# Altium schematic sheet powerSupply.SchDoc: DE:TMP:11:UC:EXPANDIDO
size 233 x 233 mm; Date: 21-07-2022; SheetNumber: 1; SheetTotal: 1; WebFGR: www.abebashop.com; VersionFGR: 20220721; PageSetup: Record=PageOptions|CenterHorizontal=True|CenterVertical=True|PrintScale=0.94|XCorrection=1.00|YCorrection=1.00|PrintKind=0|BorderSize=5000000|LeftOffset=0|BottomOffset=0|Orientation=2|PaperLength=1000|PaperWidth=1000|Scale=100|PaperSource=7|PrintQuality=-4|MediaType=1|DitherType=10|PaperKind=Letter|PrintScaleMode=1
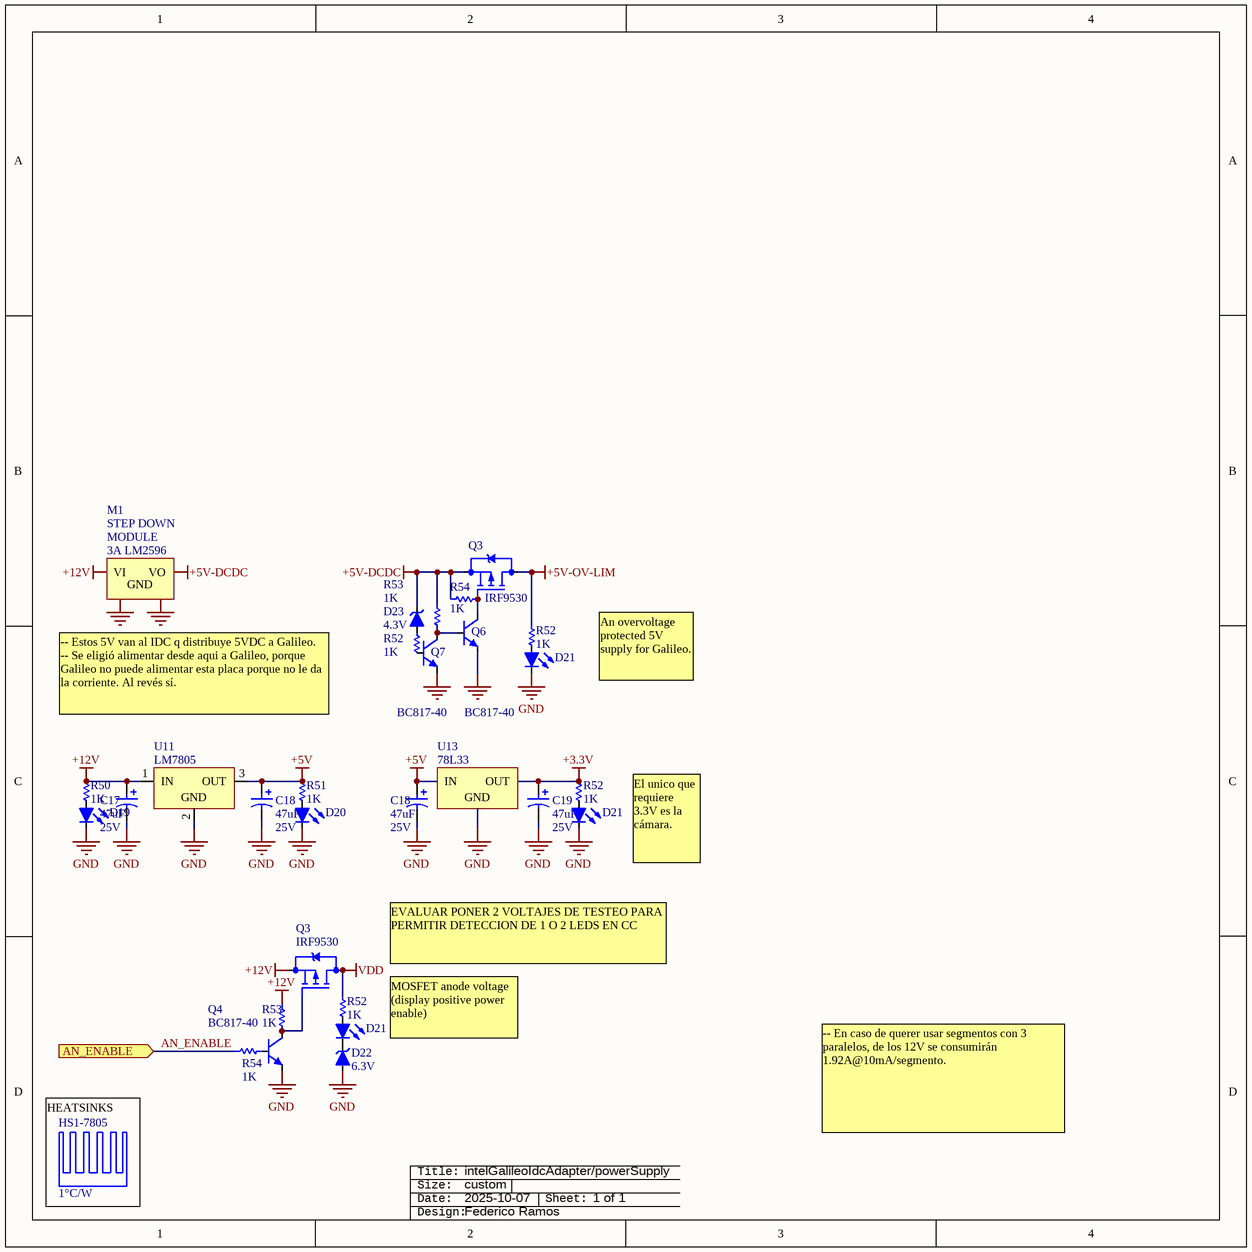
[diagram p0: powerSupply.SchDoc]

## Parts
(Parts that share a designator on the sheet are numbered #1, #2 ... from top to bottom, then left to right.)
C17  value 47uF  Voltaje: 25V  [C_EL_6-3X11]  (hidden comment: Cap Pol)
C18#1  value 47uF  Voltaje: 25V  [C_EL_6-3X11]  (hidden comment: Cap Pol)
C18#2  value 47uF  Voltaje: 25V  [C_EL_6-3X11]  (hidden comment: Cap Pol)
C19  value 47uF  Voltaje: 25V  [C_EL_6-3X11]  (hidden comment: Cap Pol)
D19  Led 5mm Rojo Difuso  [LED5mm ROJO]  (value not drawn)
D20  Led 5mm Rojo Difuso  [LED5mm ROJO]  (value not drawn)
D21#1  Led 5mm Rojo Difuso  [LED5mm ROJO]  (value not drawn)
D21#2  Led 5mm Rojo Difuso  [LED5mm ROJO]  (value not drawn)
D21#3  Led 5mm Rojo Difuso  [LED5mm ROJO]  (value not drawn)
D22  VOLTAJE: 6.3V  [D_SOD27]  (hidden comment: Zener)
D23  VOLTAJE: 4.3V  [D_SOD27]  (hidden comment: Zener)
HS1-7805  Thermal Resistance: 1°C/W  [HeatSink06]  (hidden comment: HEAT SINK)
M1  MODULE STEP DOWN 3A LM2596  [LM2596 MODULE]  (value not drawn)
Q3#1  IRF9530  [TO220]
Q3#2  IRF9530  [TO220]
Q4  BC817-40  [SOT23]
Q6  BC817-40  [SOT23]
Q7  BC817-40  [SOT23]
R50  value 1K  [R1206]  (hidden comment: Res)
R51  value 1K  [R1206]  (hidden comment: Res)
R52#1  value 1K  [R1206]  (hidden comment: Res)
R52#2  value 1K  [R1206]  (hidden comment: Res)
R52#3  value 1K  [R1206]  (hidden comment: Res)
R52#4  value 1K  [R1206]  (hidden comment: Res)
R53#1  value 1K  [R1206]  (hidden comment: Res)
R53#2  Resistencia: 1K  [R1206]  (hidden comment: Resistencia 1206; 1Kohm)
R54#1  Resistencia: 1K  [R1206]  (hidden comment: Resistencia 1206; 1Kohm)
R54#2  Resistencia: 1K  [res300th]  (hidden comment: Resistencia 1206; 1Kohm)
ROT?  Rotulo_empty  (value not drawn)  (graphical)
U11  LM7805  [TO220]
U13  78L33  [to92]

## Ports
AN_ENABLE (in)

## Nets
+3.3V: C19.1 R52#3.2 U13.1(OUT)
+5V: C18#1.1 C18#2.1 R51.2 U11.3(OUT) U13.3(IN)
+5V-DCDC: D23.2(K) M1.3(VO) Q3#1.3(S) R53#1.2 R54#1.1
+5V-OV-LIM: Q3#1.2(D) R52#1.2
+12V: C17.1 M1.1(VI) Q3#2.3(S) R50.2 R53#2.2 U11.1(IN)
GND: C17.2 C18#1.2 C18#2.2 C19.2 D19.2(K) D20.2(K) D21#1.2(K) D21#2.2(K) D22.1(A) M1.2(GND) M1.4(GND) Q4.2(E) Q6.2(E) Q7.2(E) U11.2(GND) U13.2(GND)
VDD: Q3#2.2(D) R52#4.2
AN_ENABLE: R54#2.1 ; port AN_ENABLE
NetD19_1: D19.1(A) R50.1
NetD20_1: D20.1(A) R51.1
NetD21#1_1: D21#1.1(A) R52#1.1
NetD21#2_1: D21#2.1(A) R52#3.1
NetD21#3_1: D21#3.1(A) R52#4.1
NetD21#3_2: D21#3.2(K) D22.2(K)
NetD23_1: D23.1(A) R52#2.2
NetQ3#1_1: Q3#1.1(G) Q6.3(C) R54#1.2
NetQ3#2_1: Q3#2.1(G) Q4.3(C) R53#2.1
NetQ4_1: Q4.1(B) R54#2.2
NetQ6_1: Q6.1(B) Q7.3(C) R53#1.1
NetQ7_1: Q7.1(B) R52#2.1

## Notes on the sheet
- (near M1) -- Estos 5V van al IDC q distribuye 5VDC a Galileo.
  -- Se eligió alimentar desde aqui a Galileo, porque Galileo no puede alimentar esta placa porque no le da la corriente. Al revés sí.
- An overvoltage protected 5V supply for Galileo.
- El unico que requiere 3.3V es la cámara.
- EVALUAR PONER 2 VOLTAJES DE TESTEO PARA PERMITIR DETECCION DE 1 O 2 LEDS EN CC
- MOSFET anode voltage (display positive power enable)
- -- En caso de querer usar segmentos con 3 paralelos, de los 12V se consumirán 1.92A@10mA/segmento.
- (near HS1-7805) HEATSINKS
- (near ROT?) intelGalileoIdcAdapter/powerSupply
- custom
- 2025-10-07
- (near ROT?) 1 of 1
- Federico Ramos
- (in symbol MODULE STEP DOWN 3A LM2596) STEP DOWN; MODULE; 3A LM2596
- (in symbol Rotulo_empty) Title:; Size:; Date:; Sheet:; Design:

## Library data of the parts
C17 C18#1 C18#2 C19 = Cap Pol: Capacitor Polarizado; Price: ?
D19 D20 D21#1-D21#3 = Led 5mm Rojo Difuso: Codigo Ebay: NA; Dolares Ebay: 0.06
D22 D23 = Zener: Zener Diode; Price: ?
Q3#1 Q3#2 = IRF9530: 100V  12A 0.3 ohm Power Field Effect Transistor; Revision: 17-Jul-2002: Re-released for DXP Platform.
Q4 Q6 Q7 = BC817-40: Dolares Elemon: 0.03755; Codigo Elemon: TR1723021
R50 R51 R52#1-R52#4 R53#1 = Res: Resistencia; Power: 0.25W; Price: 0.036
R53#2 R54#1 R54#2 = Resistencia 1206; 1Kohm: Codigo Elemon: RS3886185; Dolares Elemon: 0.00720
ROT? = Rotulo_empty: Rotulo [consolas]
U11 = LM78XX (v1): 3-Terminal Positive Regulator; Price: ?
U13 = 78L05; TO92: Dolares Elemon: 0.18050; Codigo Elemon: CI2707530
HS1-7805 = HEAT SINK: Price: ?